# EAGLE design new (EAGLE 9.6.2)
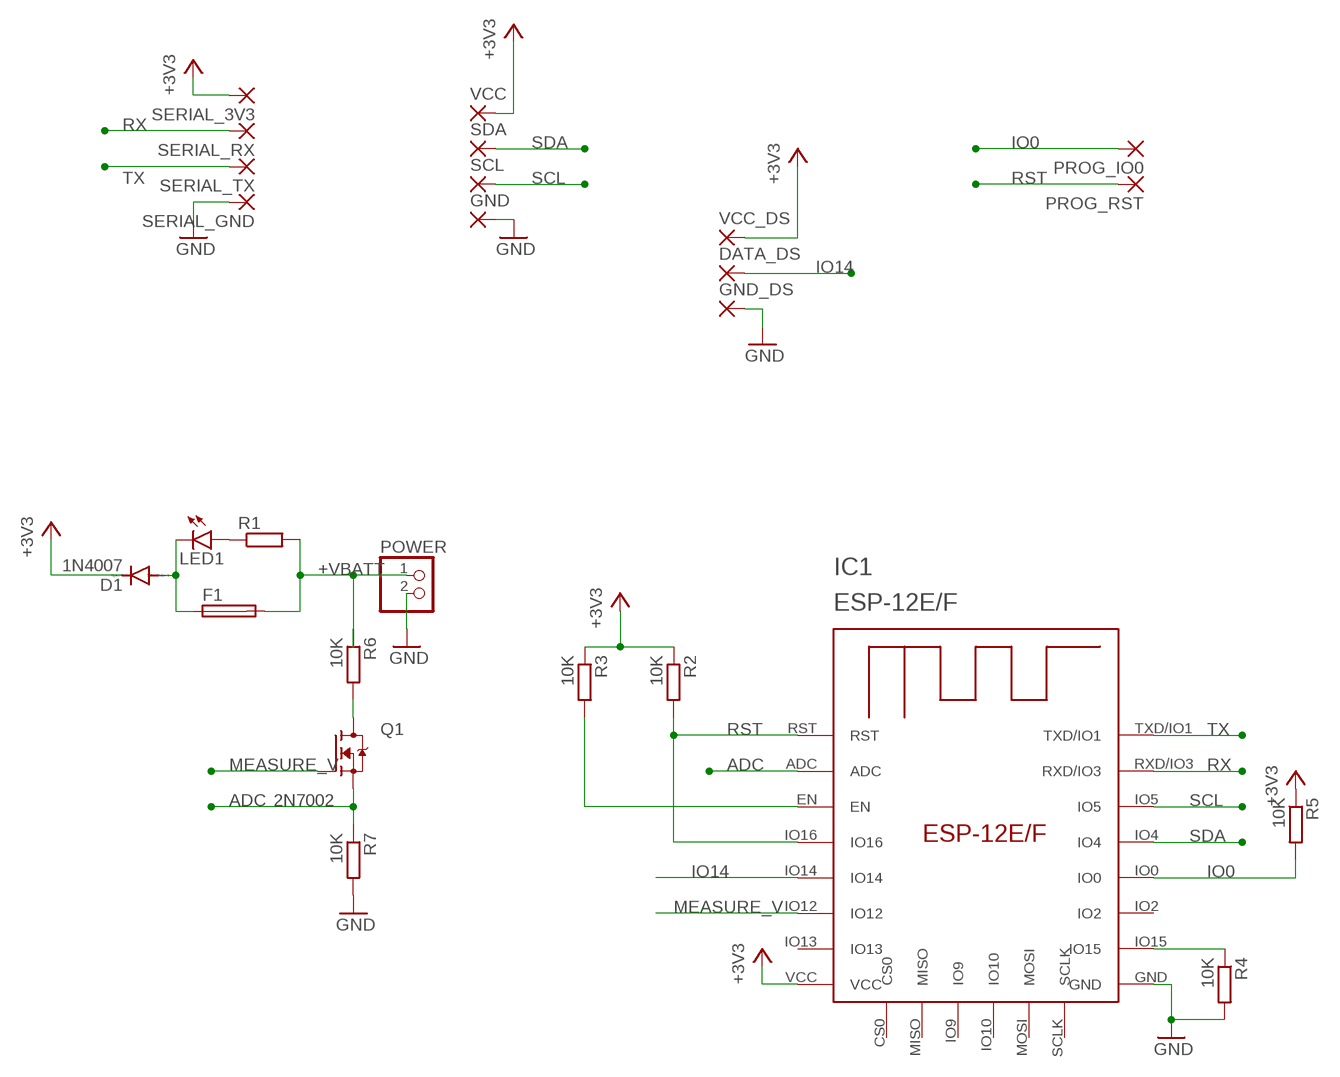
[diagram p0: schematic, sheet 1]

## Parts
D1  1N4007  1N4148DO35-7  [DO35-7]
DATA_DS  SMD2  [SMD1,27-2,54]
F1  19560  [19560]
GND  SMD2  [SMD1,27-2,54]
GND_DS  SMD2  [SMD1,27-2,54]
IC1  ESP-12E/F  [ESP-12E]
LED1  LEDSML0805  [SML0805]
POWER  PINHD-1X2  [1X02]
PROG_IO0  SMD2  [SMD1,27-2,54]
PROG_RST  SMD2  [SMD1,27-2,54]
Q1  2N7002  [SOT95P240X111-3N]
R1  R-EU_R0805  [R0805]
R2  10K  R-EU_R0805  [R0805]
R3  10K  R-EU_R0805  [R0805]
R4  10K  R-EU_R0805  [R0805]
R5  10K  R-EU_R0805  [R0805]
R6  10K  R-EU_R0805  [R0805]
R7  10K  R-EU_R0805  [R0805]
SCL  SMD2  [SMD1,27-2,54]
SDA  SMD2  [SMD1,27-2,54]
SERIAL_3V3  SMD2  [SMD1,27-2,54]
SERIAL_GND  SMD2  [SMD1,27-2,54]
SERIAL_RX  SMD2  [SMD1,27-2,54]
SERIAL_TX  SMD2  [SMD1,27-2,54]
VCC  SMD2  [SMD1,27-2,54]
VCC_DS  SMD2  [SMD1,27-2,54]

## Nets
+3V3 [power]: D1.C IC1.VCC R2.1 R3.1 R5.1 SERIAL_3V3.1(P) VCC.1(P) VCC_DS.1(P)
+VBATT [data]: F1.2 POWER.1 R1.2 R6.1
ADC [data]: IC1.ADC Q1.2(S) R7.1
GND: GND.1(P) GND_DS.1(P) IC1.GND POWER.2 R4.2 R7.2 SERIAL_GND.1(P)
IO0 [data]: IC1.IO0 PROG_IO0.1(P) R5.2
IO14 [data]: DATA_DS.1(P) IC1.IO14
MEASURE_V [data]: IC1.IO12 Q1.1(G)
N$1 [data]: LED1.A R1.1
N$2 [data]: Q1.3(D) R6.2
N$3 [data]: D1.A F1.1 LED1.C
N$4 [data]: IC1.EN R3.2
N$5 [data]: IC1.IO15 R4.1
RST [data]: IC1.IO16 IC1.RST PROG_RST.1(P) R2.2
RX [data]: IC1.RXD/IO3 SERIAL_RX.1(P)
SCL [data]: IC1.IO5 SCL.1(P)
SDA [data]: IC1.IO4 SDA.1(P)
TX [data]: IC1.TXD/IO1 SERIAL_TX.1(P)
Unconnected: IC1.CS0 IC1.IO2 IC1.IO9 IC1.IO10 IC1.IO13 IC1.MISO IC1.MOSI IC1.SCLK

## Library data of the parts
D1 = diode:1N4148: DIODE high speed (Philips)
DATA_DS GND GND_DS PROG_IO0 PROG_RST SCL SDA SERIAL_3V3 SERIAL_GND SERIAL_RX SERIAL_TX VCC VCC_DS = wirepad:SMD2: SMD PAD
F1 = fuse:19560: FUSE HOLDER TR5, Wickmann; MPN: 56000001009; OC_FARNELL: 1185363; OC_NEWARK: 15P8392
IC1 = esp-12e-f:ESP-12E/F
LED1 = led:LED: LED OSRAM: - CHIPLED LG R971, LG N971, LY N971, LG Q971, LY Q971, LO R971, LY R971 LH N974, LH R974 LS Q976, LO Q976, LY Q976 LO Q996 - Hyper CHIPLED LW Q18S LB Q993, LB Q99A, LB R99A - SideLED LS A670, LO A670, LY A670, LG A670, LP A670 LB A673, LV A673, LT A673, LW A673 LH A674 LY A675 LS A676, LA A676, LO A676, LY A676, LW A676 LS A679, LY A679, LG A679 - Hyper Micro SIDELED® LS Y876, LA Y876, LO Y876, LY Y876 LT Y87S - SmartLED LW L88C, LW L88S LB L89C, LB L89S, LG L890 LS L89K, LO L89K, LY L89K LS L896, LA L896, LO L896, LY L896 - TOPLED LS T670, LO T670, LY T670, LG T670, LP T670 LSG T670, LSP T670, LSY T670, LOP T670, LYG T670 LG T671, LOG T671, LSG T671 LB T673, LV T673, LT T673, LW T673 LH T674 LS T676, LA T676, LO T676, LY T676, LB T676, LH T676, LSB T676, LW T676 LB T67C, LV T67C, LT T67C, LS T67K, LO T67K, LY T67K, LW E67C LS E67B, LA E67B, LO E67B, LY E67B, LB E67C, LV E67C, LT E67C LW T67C LS T679, LY T679, LG T679 LS T770, LO T770, LY T770, LG T770, LP T770 LB T773, LV T773, LT T773, LW T773 LH T774 LS E675, LA E675, LY E675, LS T675 LS T776, LA T776, LO T776, LY T776, LB T776 LHGB T686 LT T68C, LB T68C - Hyper Mini TOPLED® LB M676 - Mini TOPLED Santana® LG M470 LS M47K, LO M47K, LY M47K Source: http://www.osram.convergy.de LUXEON: - LUMILED® LXK2-PW12-R00, LXK2-PW12-S00, LXK2-PW14-U00, LXK2-PW14-V00 LXK2-PM12-R00, LXK2-PM12-S00, LXK2-PM14-U00 LXK2-PE12-Q00, LXK2-PE12-R00, LXK2-PE12-S00, LXK2-PE14-T00, LXK2-PE14-U00 LXK2-PB12-K00, LXK2-PB12-L00, LXK2-PB12-M00, LXK2-PB14-N00, LXK2-PB14-P00, LXK2-PB14-Q00 LXK2-PR12-L00, LXK2-PR12-M00, LXK2-PR14-Q00, LXK2-PR14-R00 LXK2-PD12-Q00, LXK2-PD12-R00, LXK2-PD12-S00 LXK2-PH12-R00, LXK2-PH12-S00 LXK2-PL12-P00, LXK2-PL12-Q00, LXK2-PL12-R00 Source: www.luxeon.com KINGBRIGHT: KA-3528ASYC Source: www.kingbright.com
POWER = pinhead:PINHD-1X2: PIN HEADER
Q1 = 2n7002:2N7002: N-Channel 60V 280mA (Ta) 350mW (Ta) Surface Mount SOT-23-3 (TO-236) Check availability <https://pricing.snapeda.com/parts/2N7002/ON%20Semiconductor/view-part?ref=eda>; AVAILABILITY: In Stock; DESCRIPTION: Mosfet Array 2 N-Channel (Dual) 60V 300mA 500mW Surface Mount PG-SOT363-6; MF: ON Semiconductor; MP: 2N7002; PACKAGE: SOT-23-3 ON Semiconductor; PRICE: None; PURCHASE-URL: https://pricing.snapeda.com/search/part/2N7002/?ref=eda
R1-R7 = resistor:R-EU_: RESISTOR, European symbol

## Module ACCELEROMETER
Ports: 

### Library data of the parts

## Net classes
0 default: width 0.406 mm
1 power: width 0.61 mm
2 data: width 0.406 mm

## Board
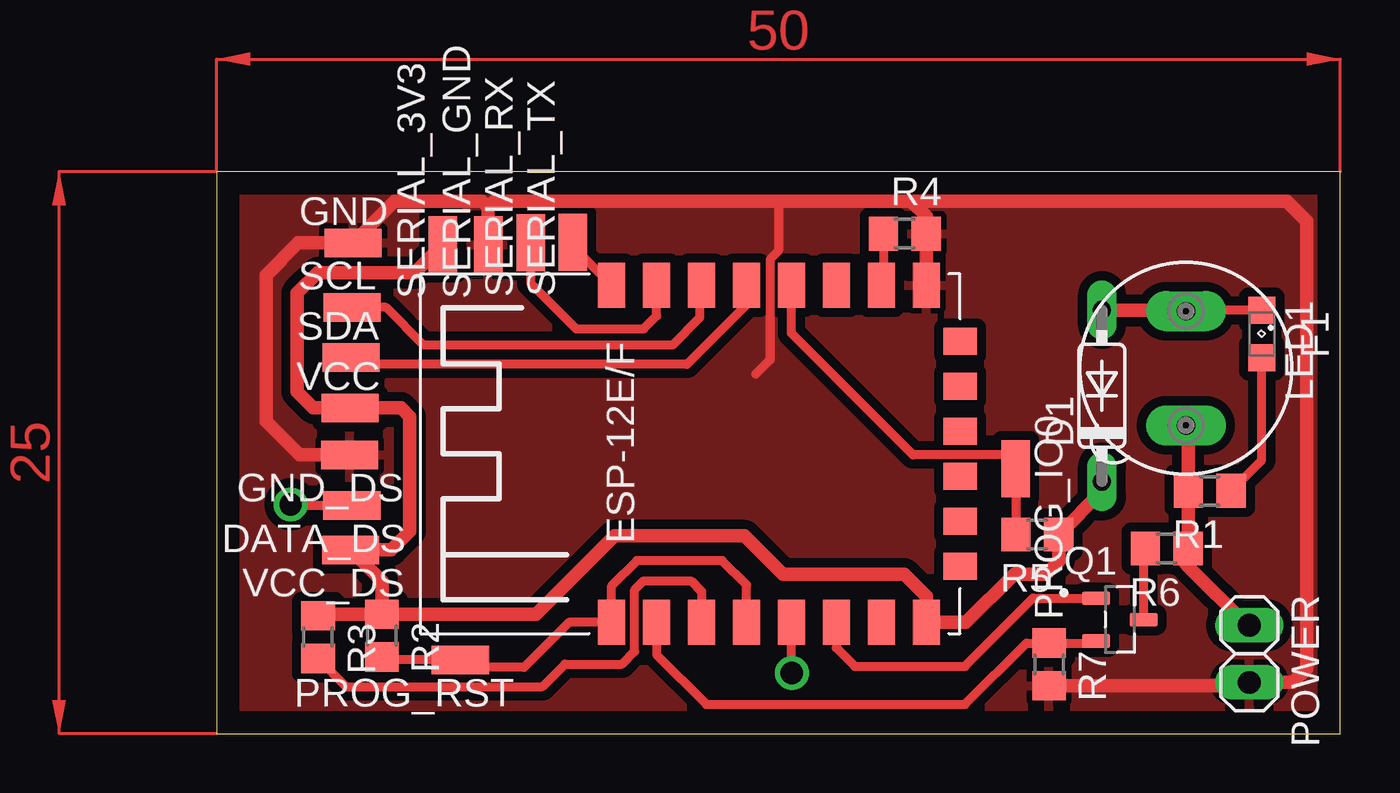
[diagram p1: board, top side]
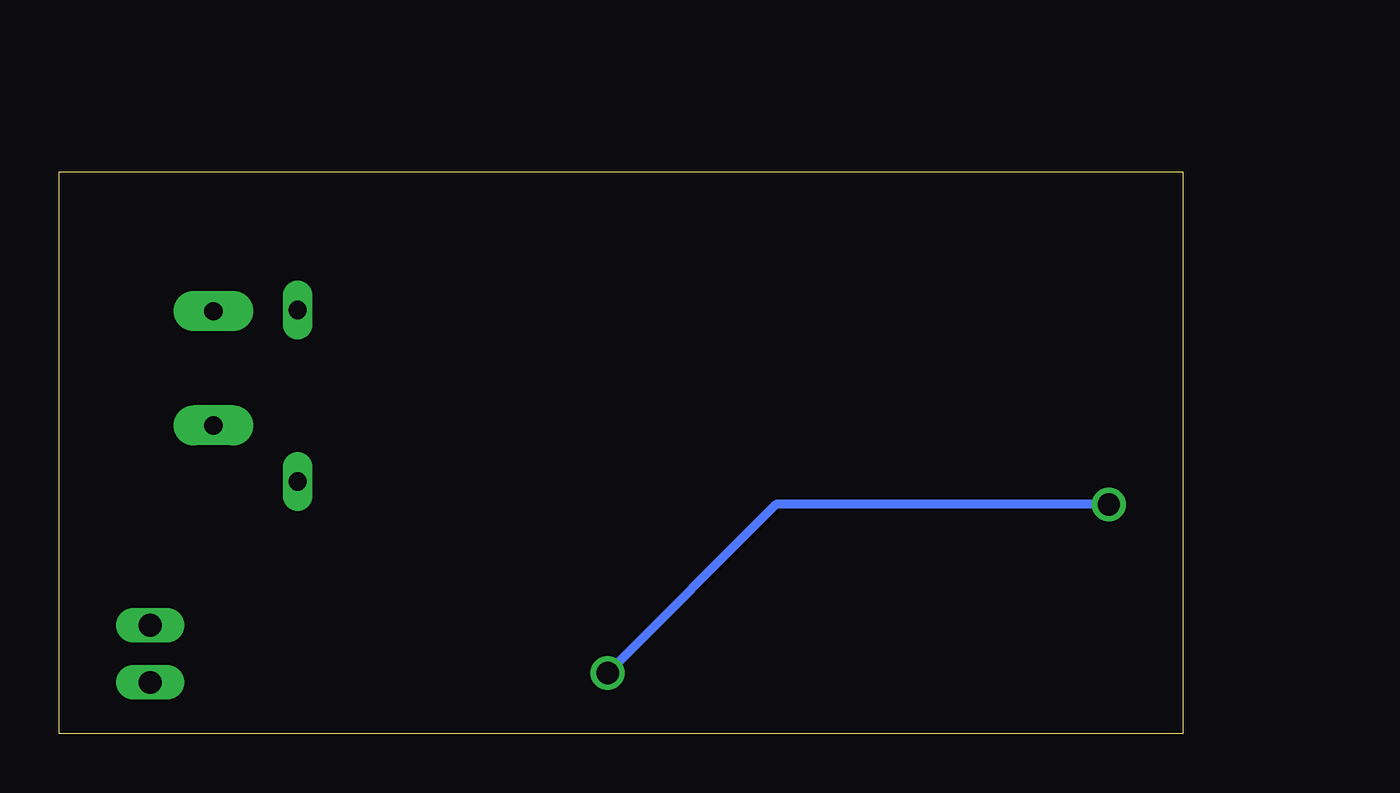
[diagram p2: board, bottom side, seen from below]

Size 50 x 25 mm. Coordinates in mm from the lower left corner, seen from the top.
Outline: 0,0 50,0 50,25 0,25 0,0
Copper layers (1*16): Top 0.035mm / dielectric 1.5mm / Bottom 0.035mm
Design rules "default": minimum track width 6mil, minimum drill 0.35mm, track to track 6mil, track to pad 6mil, pad to pad 6mil, via to via 6mil, smd to smd 6mil, copper to edge 40mil, drill to drill 6mil, minimum pad ring 10mil, minimum via ring 8mil, stop-mask expansion 4mil, vias tented up to drill 0mil, thermal gap 10mil

### Footprints (pad centres in the part's own frame; a part is rotated, then mirrored left to right if it is on the bottom)
DO35-7 = drill 0.813 long: A 3.81,0; C -3.81,0
SMD1,27-2,54 = smd 1.27 x 2.54: 1 0,0
19560 = drill 0.813 pad 1.778 long: 1 -2.54,0; 2 2.54,0
ESP-12E = smd 2 x 1.2: ADC -7.46,5.53; EN -7.46,3.53; GND 7.54,-6.47; IO0 7.54,-0.47; IO2 7.54,-2.47; IO4 7.54,1.53; IO5 7.54,3.53; IO12 -7.46,-2.47; IO13 -7.46,-4.47; IO14 -7.46,-0.47; IO15 7.54,-4.47; IO16 -7.46,1.53; RST -7.46,7.53; RXD/IO3 7.54,5.53; TXD/IO1 7.54,7.53; VCC -7.46,-6.47 | smd 1.2 x 1.5: CS0 -4.96,-7.97; IO9 -0.96,-7.97; IO10 1.04,-7.97; MISO -2.96,-7.97; MOSI 3.04,-7.97; SCLK 5.04,-7.97
SML0805 = smd 1.2 x 1.2: A 1.05,0; C -1.05,0
1X02 = drill 1.016 long: 1 -1.27,0; 2 1.27,0
SOT95P240X111-3N = smd 1.23 x 0.6: 1 -1.06,0.95; 2 -1.06,-0.95; 3 1.06,0
R0805 = smd 1.3 x 1.5: 1 -0.95,0; 2 0.95,0

### Placement (x,y rotation side)
D1  39.39,15.03 90 top
DATA_DS  6.03,10.14 90 top
F1  43.13,16.25 270 top
GND  6.07,21.82 270 top
GND_DS  5.93,12.4 90 top
IC1  25.11,12.41 90 top
LED1  46.51,17.78 270 top
POWER  45.95,3.55 270 top
PROG_IO0  35.56,11.78 180 top
PROG_RST  10.85,3.28 90 top
Q1  40.19,5.08 0 top
R1  44.19,10.8 180 top
R2  7.36,4.36 270 top
R3  4.52,4.3 270 top
R4  30.62,22.24 0 top
R5  36.52,8.86 180 top
R6  42.27,8.23 180 top
R7  37.04,3.08 270 top
SCL  6.04,18.96 270 top
SDA  5.98,16.73 270 top
SERIAL_3V3  10.07,21.75 0 top
SERIAL_GND  12.09,21.75 0 top
SERIAL_RX  13.98,21.83 0 top
SERIAL_TX  15.85,21.85 0 top
VCC  5.94,14.49 270 top
VCC_DS  5.97,8.18 90 top

### Tracks (layer width: path | path; a pad name or v marks a point on that pad's centre or on a via)
+3V3
  Top 0.61: R2.1 4.58,5.31 R3.1 | R2.1 7.36,6.79 VCC_DS.1 7.78,8.18 8.6,9 8.6,14.1 8.21,14.49 VCC.1 4.31,14.49 3.6,15.2 3.6,19.6 4.5,20.5 8.82,20.5 SERIAL_3V3.1 | R2.1 14.21,5.31 17.7,8.8 23.5,8.8 25.2,7.1 30.6,7.1 31.58,6.12 IC1.VCC 33.35,4.95 35.5,7.1 36.9,7.1 37.47,7.67 R5.1 39.39,10.78 D1.C
+VBATT
  Top 0.61: POWER.1 45.85,4.82 43.22,7.45 | 43.22,7.45 43.12,7.55 43.24,7.67 R1.2 43.24,13.61 F1.2 | 43.22,7.45 R6.1
ADC
  Top 0.406: IC1.ADC 19.58,3.52 21.8,1.3 33.3,1.3 36.03,4.03 R7.1 39.04,4.03 Q1.2
GND
  Top 0.406: 24,16 24.62,16.62 24.62,21.1 25,21.47 25,23.68
  Top 0.61: GND_DS.1 3.7,12.4 2.2,13.9 2.2,20.4 3.62,21.82 GND.1 7.93,23.68 11.82,23.68 12.09,23.41 | SERIAL_GND.1 12.09,23.41 | 12.09,23.41 12.36,23.68 25,23.68 30.9,23.68 | 30.9,23.68 31.57,23 R4.2 IC1.GND | R7.2 45.8,2.13 POWER.2 47.88,2.28 48.5,2.9 48.5,22.8 47.62,23.68 30.9,23.68
  pour Top (isolate 0.406): 0,25 50,25 50,0 0,0
IO0
  Top 0.406: IC1.IO0 25.58,17.82 30.99,12.41 35.31,12.41 35.4,12.5 35.56,12.34 PROG_IO0.1 R5.2
IO14  (via drill 1)
  Top 0.406: DATA_DS.1 3.36,10.14 v3.3,10.2 | v25.6,2.7 25.58,2.72 IC1.IO14
  Bottom 0.406: v3.3,10.2 18.1,10.2 v25.6,2.7
MEASURE_V
  Top 0.406: IC1.IO12 27.58,3.82 28.4,3 33.3,3 36.33,6.03 Q1.1
N$1
  Top 0.406: R1.1 46.5,12.16 LED1.A
N$2
  Top 0.406: Q1.3 41.25,8.16 R6.2
N$3
  Top 0.406: LED1.C 43.16,18.83 F1.1
  Top 0.61: D1.A 43.15,18.84 43.16,18.83
N$4
  Top 0.406: R3.2 5.77,2.1 14.5,2.1 15.5,3.1 18.03,3.1 18.6,3.67 18.6,6.4 19,6.8 21.1,6.8 21.58,6.32 IC1.EN
N$5
  Top 0.406: R4.1 29.67,20.04 IC1.IO15
RST
  Top 0.406: R2.2 7.49,3.28 PROG_RST.1 11.18,2.95 13.68,2.95 15.68,4.95 IC1.RST 17.58,6.58 18.7,7.7 22.5,7.7 23.58,6.62 IC1.IO16
RX
  Top 0.406: SERIAL_RX.1 13.98,20.02 16,18 19,18 19.58,18.58 IC1.RXD/IO3
SCL
  Top 0.406: IC1.IO5 21.5,19.87 21.5,18.5 20.29,17.29 9.21,17.29 7.54,18.96 SCL.1
SDA
  Top 0.406: SDA.1 6.28,16.43 20.93,16.43 23.58,19.08 IC1.IO4
TX
  Top 0.406: IC1.TXD/IO1 15.85,21.68 SERIAL_TX.1
(copper drawn outside any net)
  shapes: Top area x2